# EAGLE schematic apple-idun (EAGLE 7.3.0)

## Sheet 1 of 2: I/O & Supply
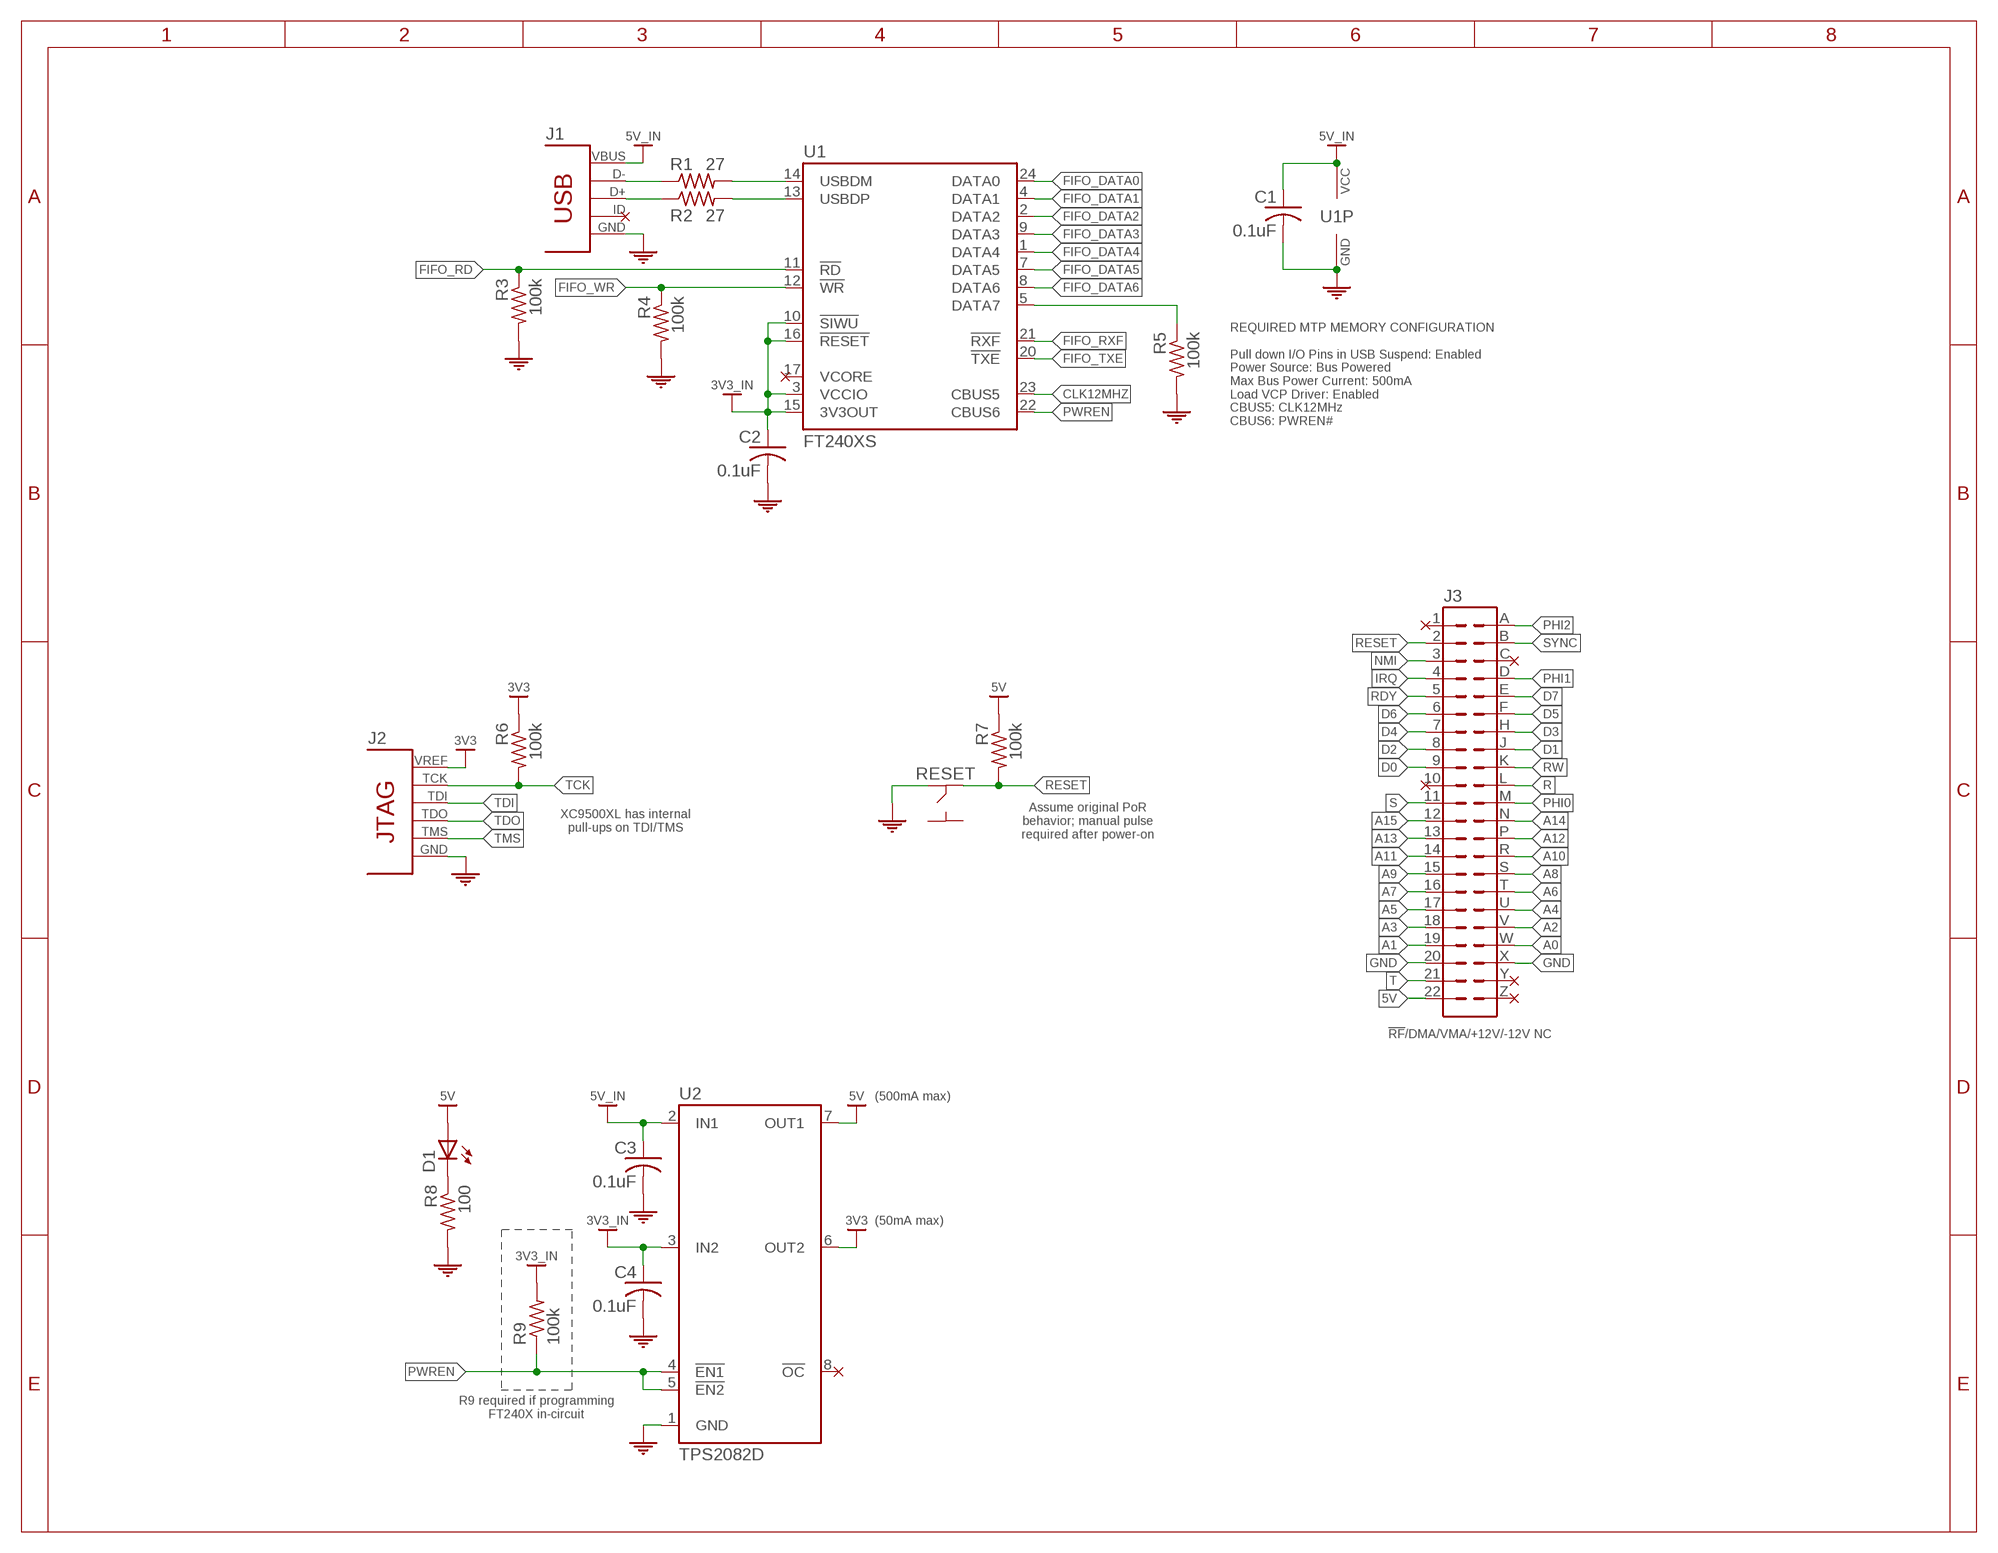
[diagram p0: schematic, sheet 1]

### Parts
C1  0.1uF  C-USC0805  [C0805]
C2  0.1uF  C-USC0805  [C0805]
C3  0.1uF  C-USC0805  [C0805]
C4  0.1uF  C-USC0805  [C0805]
D1  LEDCHIP-LED0805  [CHIP-LED0805]
J1  USBMICROB  [USBMICROB]
J2  JTAG  [JTAG]
J3  CON2X22  [CON2X22]
R1  27  R-US_R0805  [R0805]
R2  27  R-US_R0805  [R0805]
R3  100k  R-US_R0805  [R0805]
R4  100k  R-US_R0805  [R0805]
R5  100k  R-US_R0805  [R0805]
R6  100k  R-US_R0805  [R0805]
R7  100k  R-US_R0805  [R0805]
R8  100  R-US_R0805  [R0805]
R9  100k  R-US_R0805  [R0805]
RESET  TACTSW  [TACTSW]
U1  FT240XS  [SSOP24]
U2  TPS2082D  [SOIC8]

### Nets
3V3 [supply]: J2.VREF R6.1 U2.6(OUT2)
3V3_IN [supply]: C2.1 C4.1 R9.2 U1.3(VCCIO) U1.10(!SIWU) U1.15(3V3OUT) U1.16(!RESET) U2.3(IN2)
5V [supply]: D1.A J3.22 R7.1 U2.7(OUT1)
5V_IN [supply]: C1.1 C3.1 J1.1 U1.18(VCC) U2.2(IN1)
A0: J3.W
A1: J3.19
A2: J3.V
A3: J3.18
A4: J3.U
A5: J3.17
A6: J3.T
A7: J3.16
A8: J3.S
A9: J3.15
A10: J3.R
A11: J3.14
A12: J3.P
A13: J3.13
A14: J3.N
A15: J3.12
CLK12MHZ: U1.23(CBUS5)
D0: J3.9
D1: J3.J
D2: J3.8
D3: J3.H
D4: J3.7
D5: J3.F
D6: J3.6
D7: J3.E
FIFO_DATA0: U1.24(DATA0)
FIFO_DATA1: U1.4(DATA1)
FIFO_DATA2: U1.2(DATA2)
FIFO_DATA3: U1.9(DATA3)
FIFO_DATA4: U1.1(DATA4)
FIFO_DATA5: U1.7(DATA5)
FIFO_DATA6: U1.8(DATA6)
FIFO_RD: R3.1 U1.11(!RD)
FIFO_RXF: U1.21(!RXF)
FIFO_TXE: U1.20(!TXE)
FIFO_WR: R4.1 U1.12(!WR)
GND [supply]: C1.2 C2.2 C3.2 C4.2 J1.5 J1.6 J1.7 J1.8 J1.9 J2.GND J3.20 J3.X R3.2 R4.2 R5.2 R8.2 RESET.1 U1.6(GND) U1.19(GND) U2.1(GND)
IRQ: J3.4
N$1: D1.C R8.1
N$1_N: J1.2 R1.1
N$2: R5.1 U1.5(DATA7)
N$2_N: R1.2 U1.14(USBDM)
N$3_P: J1.3 R2.1
N$4_P: R2.2 U1.13(USBDP)
NMI: J3.3
PHI0: J3.M
PHI1: J3.D
PHI2: J3.A
PWREN: R9.1 U1.22(CBUS6) U2.4(!EN1) U2.5(!EN2)
R: J3.L
RDY: J3.5
RESET: J3.2 R7.2 RESET.2
RW: J3.K
S: J3.11
SYNC: J3.B
T: J3.21
TCK: J2.TCK R6.2
TDI: J2.TDI
TDO: J2.TDO
TMS: J2.TMS
Unconnected: J1.4 J3.1 J3.10 J3.C J3.Y J3.Z RESET.3 RESET.4 U2.8(!OC)

### Notes on the sheet
- REQUIRED MTP MEMORY CONFIGURATION
  
  Pull down I/O Pins in USB Suspend: Enabled
  Power Source: Bus Powered
  Max Bus Power Current: 500mA
  Load VCP Driver: Enabled
  CBUS5: CLK12MHz
  CBUS6: PWREN#
- XC9500XL has internal
  pull-ups on TDI/TMS
- Assume original PoR
  behavior; manual pulse
  required after power-on
- !RF!/DMA/VMA/+12V/-12V NC
- (500mA max)
- (50mA max)
- R9 required if programming
  FT240X in-circuit

## Sheet 2 of 2: Logic
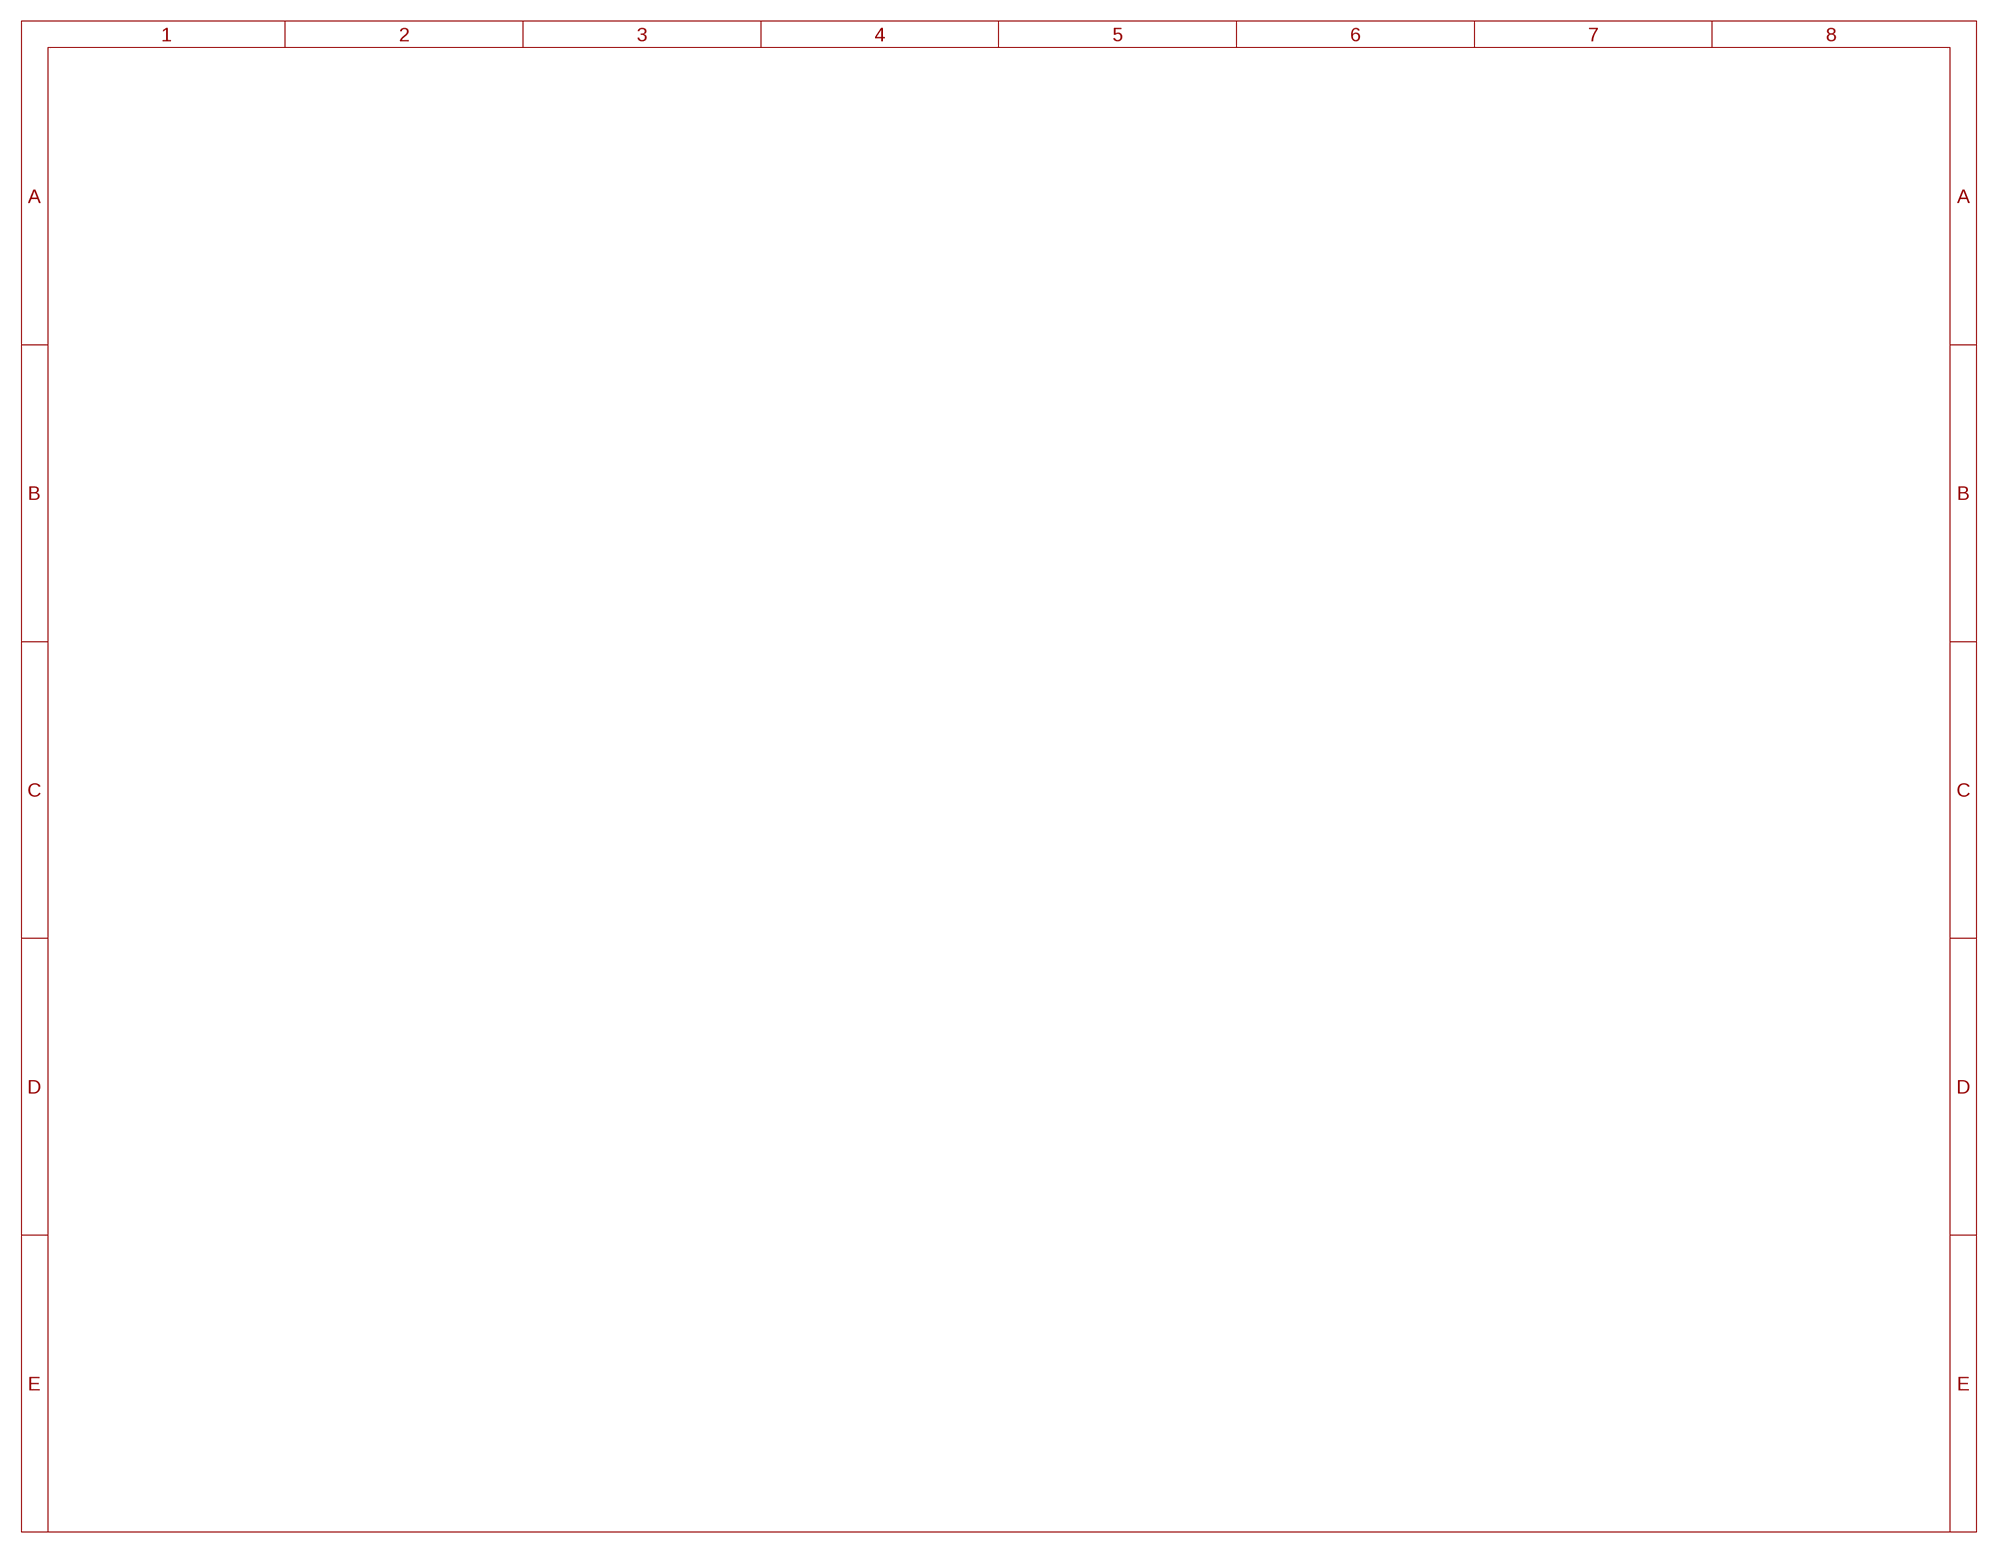
[diagram p1: schematic, sheet 2]

## Power pins joined to a net without a drawn wire
VCORE: U1.17(VCORE)

## Library data of the parts
C1-C4 = rcl:C-US: CAPACITOR, American symbol
D1 = led:LED: LED OSRAM: - CHIPLED LG R971, LG N971, LY N971, LG Q971, LY Q971, LO R971, LY R971 LH N974, LH R974 LS Q976, LO Q976, LY Q976 LO Q996 - Hyper CHIPLED LW Q18S LB Q993, LB Q99A, LB R99A - SideLED LS A670, LO A670, LY A670, LG A670, LP A670 LB A673, LV A673, LT A673, LW A673 LH A674 LY A675 LS A676, LA A676, LO A676, LY A676, LW A676 LS A679, LY A679, LG A679 - Hyper Micro SIDELED® LS Y876, LA Y876, LO Y876, LY Y876 LT Y87S - SmartLED LW L88C, LW L88S LB L89C, LB L89S, LG L890 LS L89K, LO L89K, LY L89K LS L896, LA L896, LO L896, LY L896 - TOPLED LS T670, LO T670, LY T670, LG T670, LP T670 LSG T670, LSP T670, LSY T670, LOP T670, LYG T670 LG T671, LOG T671, LSG T671 LB T673, LV T673, LT T673, LW T673 LH T674 LS T676, LA T676, LO T676, LY T676, LB T676, LH T676, LSB T676, LW T676 LB T67C, LV T67C, LT T67C, LS T67K, LO T67K, LY T67K, LW E67C LS E67B, LA E67B, LO E67B, LY E67B, LB E67C, LV E67C, LT E67C LW T67C LS T679, LY T679, LG T679 LS T770, LO T770, LY T770, LG T770, LP T770 LB T773, LV T773, LT T773, LW T773 LH T774 LS E675, LA E675, LY E675, LS T675 LS T776, LA T776, LO T776, LY T776, LB T776 LHGB T686 LT T68C, LB T68C - Hyper Mini TOPLED® LB M676 - Mini TOPLED Santana® LG M470 LS M47K, LO M47K, LY M47K Source: http://www.osram.convergy.de LUXEON: - LUMILED® LXK2-PW12-R00, LXK2-PW12-S00, LXK2-PW14-U00, LXK2-PW14-V00 LXK2-PM12-R00, LXK2-PM12-S00, LXK2-PM14-U00 LXK2-PE12-Q00, LXK2-PE12-R00, LXK2-PE12-S00, LXK2-PE14-T00, LXK2-PE14-U00 LXK2-PB12-K00, LXK2-PB12-L00, LXK2-PB12-M00, LXK2-PB14-N00, LXK2-PB14-P00, LXK2-PB14-Q00 LXK2-PR12-L00, LXK2-PR12-M00, LXK2-PR14-Q00, LXK2-PR14-R00 LXK2-PD12-Q00, LXK2-PD12-R00, LXK2-PD12-S00 LXK2-PH12-R00, LXK2-PH12-S00 LXK2-PL12-P00, LXK2-PL12-Q00, LXK2-PL12-R00 Source: www.luxeon.com KINGBRIGHT: KA-3528ASYC Source: www.kingbright.com
J1 = apple-idun:USBMICRO: FCI Micro USB Type B Receptacle
J2 = apple-idun:JTAG
J3 = apple-idun:CON2X22: Sullins RBM22DRTN
R1-R9 = rcl:R-US_: RESISTOR, American symbol
RESET = apple-idun:TACTSW: C&K PTS645 Series 6mm Tact Switch
U1 = apple-idun:FT240X: FTDI FT240X Full Speed USB to 8-bit FIFO This USB2.0 Full Speed IC offers a compact bridge to 8 bit wide FIFO interfaces. The device is a FIFO, capable of operating up to 1 MByte/s, with low power consumption (8mA). The FT240X includes the complete FT-X series feature set and enables USB to be added into a system design quickly and easily over a 8 bit wide FIFO interface http://www.ftdichip.com/Products/ICs/FT240X.html
U2 = apple-idun:TPS2082: TI TPS2082D High-Side MOSFET Switch IC The TPS2080, TPS2081, and TPS2082 dual and the TPS2085, TPS2086 and TPS2087 quad power-distribution switches are intended for applications where heavy capacitive loads and short circuits are likely to be encountered. http://www.ti.com/product/tps2082

## Net classes
0 default: width 0.203 mm, clearance 0.203 mm
1 supply: width 0.305 mm, clearance 0.305 mm